# Altium project Venus Board V02.PrjPcb
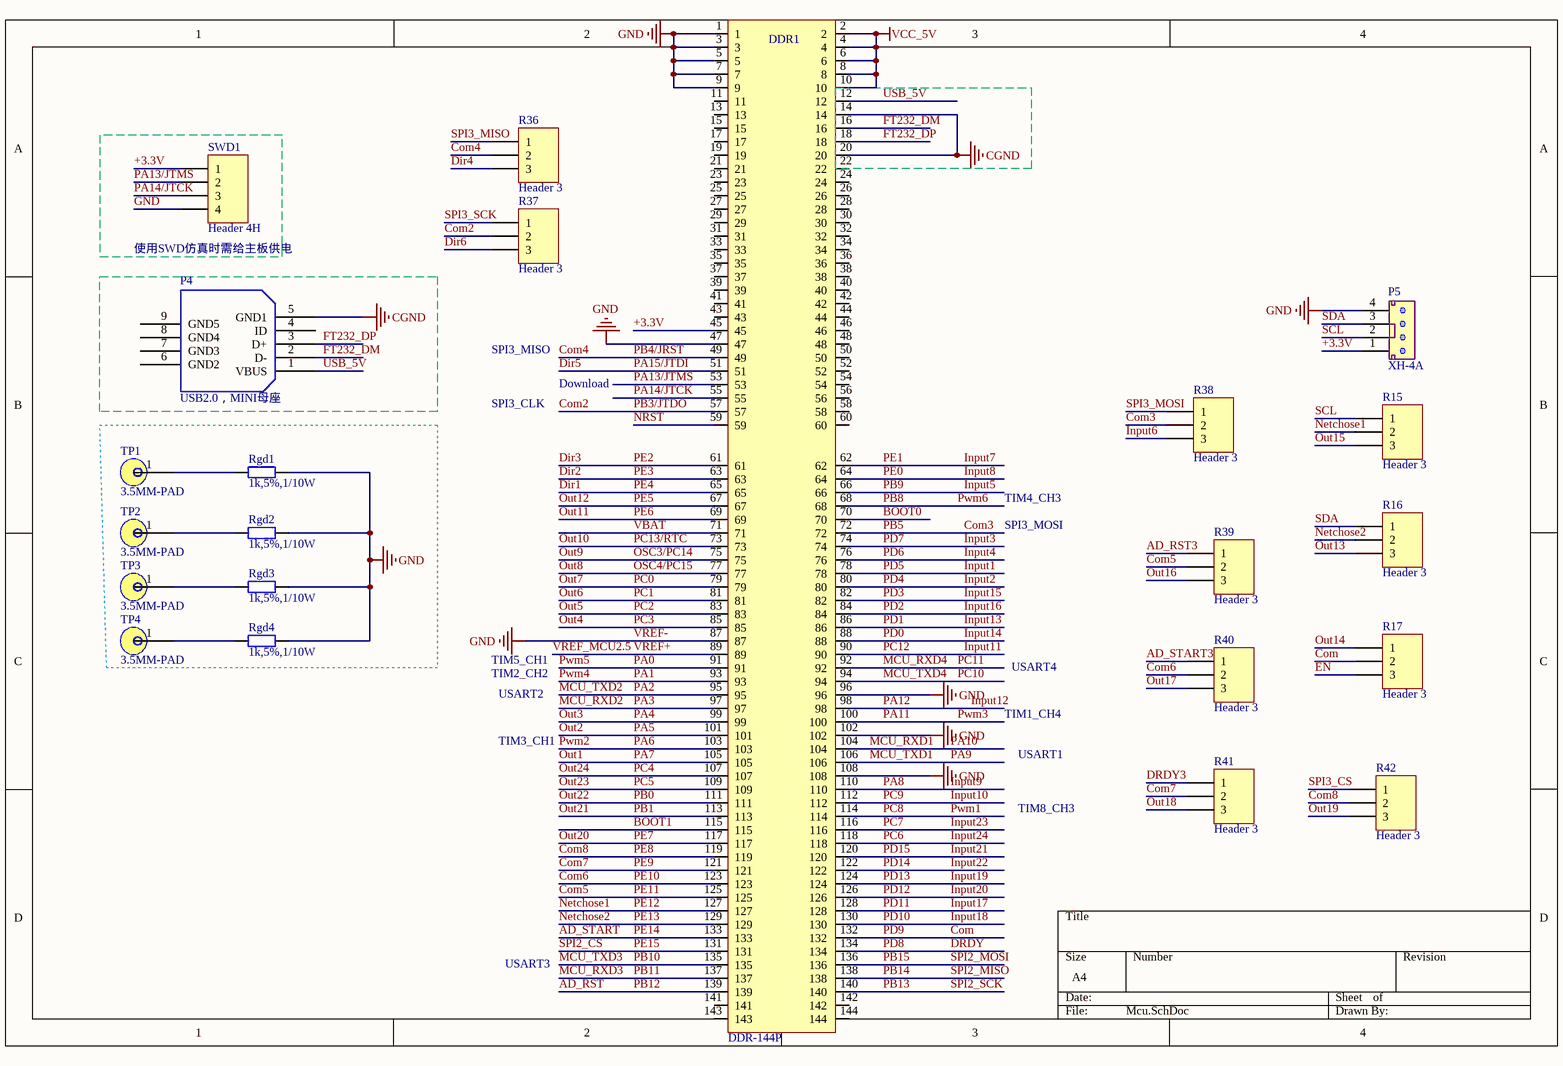
[diagram p0: Mcu.SchDoc]
7 sheets, 135 parts. Net scope: global (net labels, ports and power ports of the same name join across sheets).
Board file: Venus Board V02.PcbDoc
Sheets:
  Mcu.SchDoc
  Power.SchDoc
  Input.SchDoc
  Output.SchDoc
  Uart.SchDoc
  Motor.SchDoc
  ADS1248.SchDoc

## Sheet Mcu.SchDoc
size A4

### Parts
DDR1  DDR-144P  [DDRB-144P-0.8MM]
P4  USB2.0，MINI母座  [USB2.0-MINI]
P5  XH-4A  [CN4-3.5]
R15  Header 3  [3P-0603]
R16  Header 3  [3P-0603]
R17  Header 3  [3P-0603]
R36  Header 3  [3P-0603]
R37  Header 3  [3P-0603]
R38  Header 3  [3P-0603]
R39  Header 3  [3P-0603]
R40  Header 3  [3P-0603]
R41  Header 3  [3P-0603]
R42  Header 3  [3P-0603]
Rgd1  1k,5%,1/10W  [0603R]
Rgd2  1k,5%,1/10W  [0603R]
Rgd3  1k,5%,1/10W  [0603R]
Rgd4  1k,5%,1/10W  [0603R]
SWD1  Header 4H  [SIP4-2.54mm]
TP1  3.5MM-PAD  [PAD3.5mm]
TP2  3.5MM-PAD  [PAD3.5mm]
TP3  3.5MM-PAD  [PAD3.5mm]
TP4  3.5MM-PAD  [PAD3.5mm]

### Blocks framed on the sheet
使用SWD仿真时需给主板供电: SWD1

### Nets
+3.3V: DDR1.45 P5.1 SWD1.1
CGND: DDR1.14 DDR1.20 P4.5(GND1)
GND: DDR1.1 DDR1.3 DDR1.5 DDR1.7 DDR1.9 DDR1.47 DDR1.87 DDR1.96 DDR1.102 DDR1.108 P5.4 Rgd1.2 Rgd2.2 Rgd3.2 Rgd4.2 SWD1.4  [also labelled VREF-]
VCC_5V: DDR1.2 DDR1.4 DDR1.6 DDR1.8 DDR1.10
AD_RST: DDR1.139  [also labelled PB12]
AD_RST3: R39.1
AD_START: DDR1.133  [also labelled PE14]
AD_START3: R40.1
BOOT0: DDR1.70
BOOT1: DDR1.115
Com: DDR1.132 R17.2  [also labelled PD9]
Com2: DDR1.57 R37.2  [also labelled PB3/JTDO]
Com3: DDR1.72 R38.2  [also labelled PB5]
Com4: DDR1.49 R36.2  [also labelled PB4/JRST]
Com5: DDR1.125 R39.2  [also labelled PE11]
Com6: DDR1.123 R40.2  [also labelled PE10]
Com7: DDR1.121 R41.2  [also labelled PE9]
Com8: DDR1.119 R42.2  [also labelled PE8]
Dir1: DDR1.65  [also labelled PE4]
Dir2: DDR1.63  [also labelled PE3]
Dir3: DDR1.61  [also labelled PE2]
Dir4: R36.3
Dir5: DDR1.51  [also labelled PA15/JTDI]
Dir6: R37.3
DRDY: DDR1.134  [also labelled PD8]
DRDY3: R41.1
~{EN}: R17.3
FT232_DM: DDR1.16 P4.2(D-)
FT232_DP: DDR1.18 P4.3(D+)
Input1: DDR1.78  [also labelled PD5]
Input2: DDR1.80  [also labelled PD4]
Input3: DDR1.74  [also labelled PD7]
Input4: DDR1.76  [also labelled PD6]
Input5: DDR1.66  [also labelled PB9]
Input6: R38.3
Input7: DDR1.62  [also labelled PE1]
Input8: DDR1.64  [also labelled PE0]
Input9: DDR1.110  [also labelled PA8]
Input10: DDR1.112  [also labelled PC9]
Input11: DDR1.90  [also labelled PC12]
Input12: DDR1.98  [also labelled PA12]
Input13: DDR1.86  [also labelled PD1]
Input14: DDR1.88  [also labelled PD0]
Input15: DDR1.82  [also labelled PD3]
Input16: DDR1.84  [also labelled PD2]
Input17: DDR1.128  [also labelled PD11]
Input18: DDR1.130  [also labelled PD10]
Input19: DDR1.124  [also labelled PD13]
Input20: DDR1.126  [also labelled PD12]
Input21: DDR1.120  [also labelled PD15]
Input22: DDR1.122  [also labelled PD14]
Input23: DDR1.116  [also labelled PC7]
Input24: DDR1.118  [also labelled PC6]
MCU_RXD1: DDR1.104  [also labelled PA10]
MCU_RXD2: DDR1.97  [also labelled PA3]
MCU_RXD3: DDR1.137  [also labelled PB11]
MCU_RXD4: DDR1.92  [also labelled PC11]
MCU_TXD1: DDR1.106  [also labelled PA9]
MCU_TXD2: DDR1.95  [also labelled PA2]
MCU_TXD3: DDR1.135  [also labelled PB10]
MCU_TXD4: DDR1.94  [also labelled PC10]
Netchose1: DDR1.127 R15.2  [also labelled PE12]
Netchose2: DDR1.129 R16.2  [also labelled PE13]
NRST: DDR1.59
OSC3/PC14: DDR1.75  [also labelled Out9]
OSC4/PC15: DDR1.77  [also labelled Out8]
Out1: DDR1.105  [also labelled PA7]
Out2: DDR1.101  [also labelled PA5]
Out3: DDR1.99  [also labelled PA4]
Out4: DDR1.85  [also labelled PC3]
Out5: DDR1.83  [also labelled PC2]
Out6: DDR1.81  [also labelled PC1]
Out7: DDR1.79  [also labelled PC0]
Out10: DDR1.73  [also labelled PC13/RTC]
Out11: DDR1.69  [also labelled PE6]
Out12: DDR1.67  [also labelled PE5]
Out13: R16.3
Out14: R17.1
Out15: R15.3
Out16: R39.3
Out17: R40.3
Out18: R41.3
Out19: R42.3
Out20: DDR1.117  [also labelled PE7]
Out21: DDR1.113  [also labelled PB1]
Out22: DDR1.111  [also labelled PB0]
Out23: DDR1.109  [also labelled PC5]
Out24: DDR1.107  [also labelled PC4]
PA0: DDR1.91  [also labelled Pwm5]
PA1: DDR1.93  [also labelled Pwm4]
PA6: DDR1.103  [also labelled Pwm2]
PA11: DDR1.100  [also labelled Pwm3]
PA13/JTMS: DDR1.53 SWD1.2
PA14/JTCK: DDR1.55 SWD1.3
PB8: DDR1.68  [also labelled Pwm6]
PB13: DDR1.140  [also labelled SPI2_SCK]
PB14: DDR1.138  [also labelled SPI2_MISO]
PB15: DDR1.136  [also labelled SPI2_MOSI]
PC8: DDR1.114  [also labelled Pwm1]
PE15: DDR1.131  [also labelled SPI2_CS]
SCL: P5.2 R15.1
SDA: P5.3 R16.1
SPI3_CS: R42.1
SPI3_MISO: R36.1
SPI3_MOSI: R38.1
SPI3_SCK: R37.1
USB_5V: DDR1.12 P4.1(VBUS)
VBAT: DDR1.71
VREF+: DDR1.89  [also labelled VREF_MCU2.5]
NetRgd1_1: Rgd1.1 TP1.1
NetRgd2_1: Rgd2.1 TP2.1
NetRgd3_1: Rgd3.1 TP3.1
NetRgd4_1: Rgd4.1 TP4.1

Not connected (* = marked no-connect by the designer): DDR1 11 13 15 17 19 21 22 23 24 25 26 27 28 29 30 31 32 33 34 35 36 37 38 39 40 41 42 43 44 46 48 50 52 54 56 58 60 141 142 143 144; P4 4(ID) 6(GND2) 7(GND3) 8(GND4) 9(GND5)

### Notes on the sheet
- SPI3_MISO
- Download
- SPI3_CLK
- TIM4_CH3
- SPI3_MOSI
- TIM5_CH1
- USART4
- TIM2_CH2
- USART2
- TIM1_CH4
- TIM3_CH1
- USART1
- TIM8_CH3
- USART3

### Library data of the parts
P4 = USB2.0-MINI: USB插座,MINI型母座,USB2.0; 料号: 10705-00008-00; 品名: 数据接口连接器
P5 = CON4
R15-R17 R36-R42 = Header 3: Header, 3-Pin; LatestRevisionDate: 17-Jul-2002; LatestRevisionNote: Re-released for DXP Platform.; Publisher: Altium Limited
Rgd1-Rgd4 = R1K-0603: Metal Film Resistance,金属膜电阻,1K,1%,1/10W,0603; 料号: 11011K0001-000
SWD1 = Header 4H: Header, 4-Pin, Right Angle; LatestRevisionDate: 17-Jul-2002; LatestRevisionNote: Re-released for DXP Platform.; Publisher: Altium Limited

## Sheet Power.SchDoc
size A4
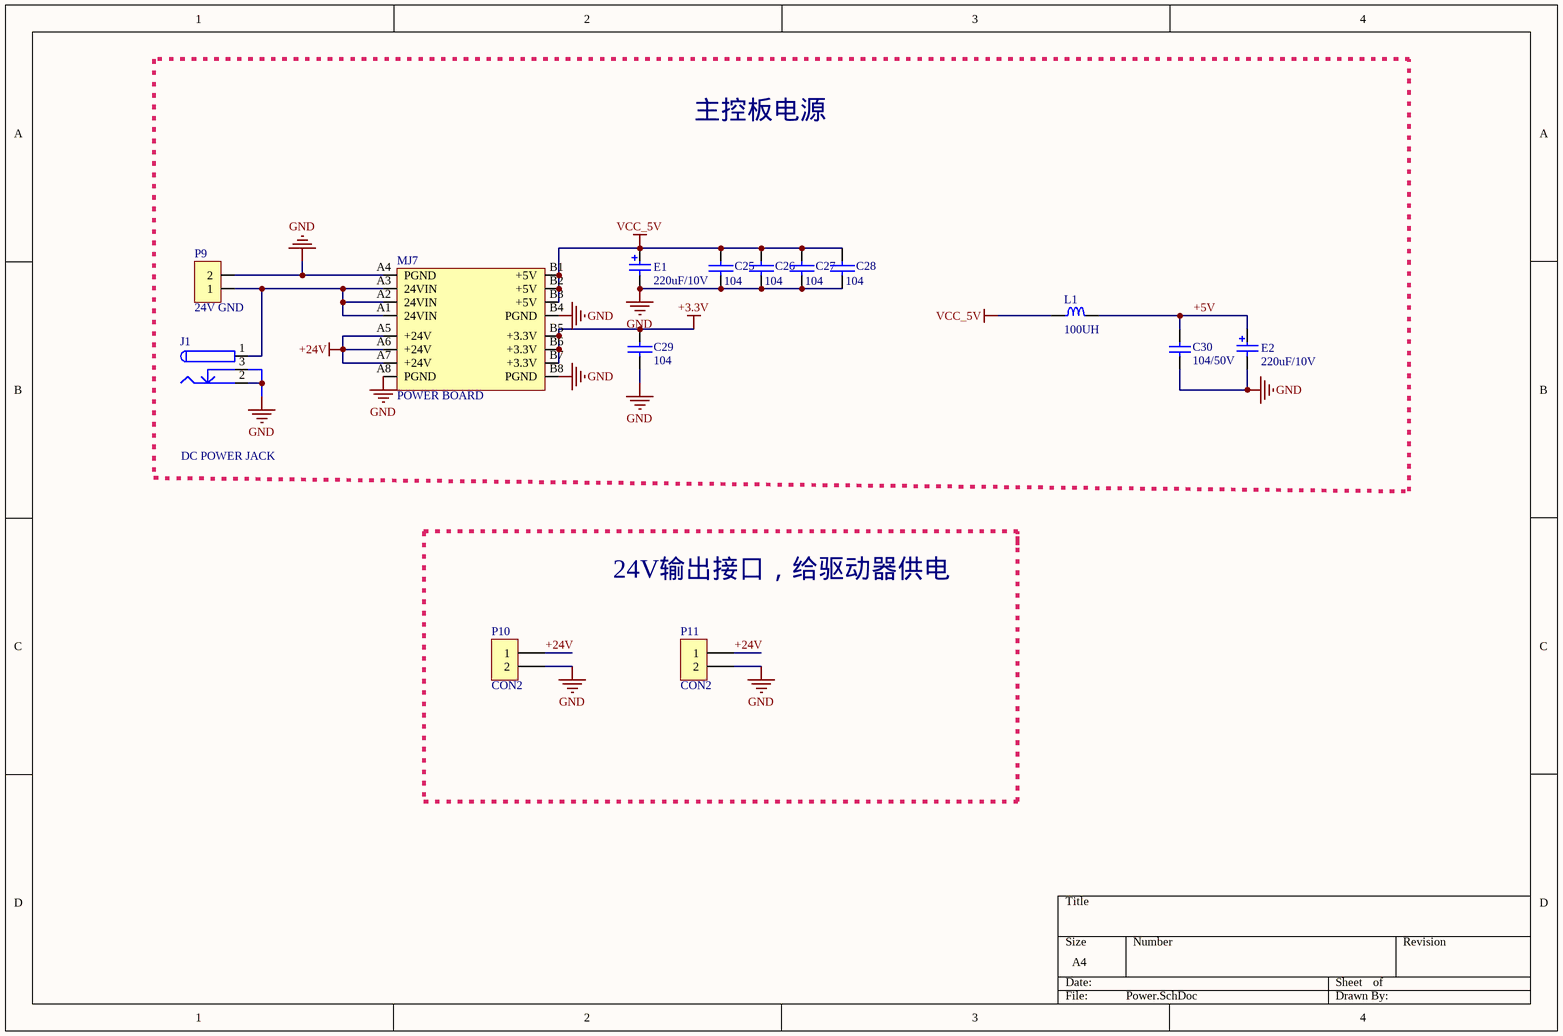
[diagram p1: Power.SchDoc]

### Parts
C25  104  [0603C]
C26  104  [0603C]
C27  104  [0603C]
C28  104  [0603C]
C29  104  [0603C]
C30  104/50V  [0603C]
E1  220uF/10V  [3216]
E2  220uF/10V  [3216]
J1  DC POWER JACK  [DC-005]
L1  100UH  [L-SMD7.4*7.4]
MJ7  POWER BOARD  [POWER BOARD]
P9  24V GND  [KF124-2P-3.5]
P10  CON2  [KF124-2P-3.5]
P11  CON2  [KF124-2P-3.5]

### Blocks framed on the sheet
主控板电源: C25-C30 E1 E2 J1 L1 MJ7 P9

### Nets
+3.3V: C29.2 MJ7.B5(+3.3V) MJ7.B6(+3.3V) MJ7.B7(+3.3V)
+5V: C30.2 E2.1 L1.2
+24V: MJ7.A5(+24V) MJ7.A6(+24V) MJ7.A7(+24V) P10.1 P11.1
GND: C25.2 C26.2 C27.2 C28.2 C29.1 C30.1 E1.2 E2.2 J1.2 J1.3 MJ7.A4(PGND) MJ7.A8(PGND) MJ7.B4(PGND) MJ7.B8(PGND) P9.2 P10.2 P11.2
VCC_5V: C25.1 C26.1 C27.1 C28.1 E1.1 L1.1 MJ7.B1(+5V) MJ7.B2(+5V) MJ7.B3(+5V)
NetJ1_1: J1.1 MJ7.A1(24VIN) MJ7.A2(24VIN) MJ7.A3(24VIN) P9.1

### Notes on the sheet
- 24V输出接口，给驱动器供电

### Library data of the parts
C25-C28 = CAP: Capacitor
C29 = CAP
C30 = C10uF/50V-0805: 瓷片电容,10uF,5%,X7R,50V,0805; 料号: 10201-10053-00; 品名: 瓷片电容
E1 E2 = 电解电容: Bi-Polar Capacitor; Value: 220uF/10V
L1 = INDUCTOR: 电感
MJ7 = J-PW
P9 = KF127-5.08-2P: 欧式接线端子，KF127-5.08-2P,2PIN，5.08mm; 料号: 10701-00036-00; 品名: 线对板连接器

## Sheet Input.SchDoc
size A4
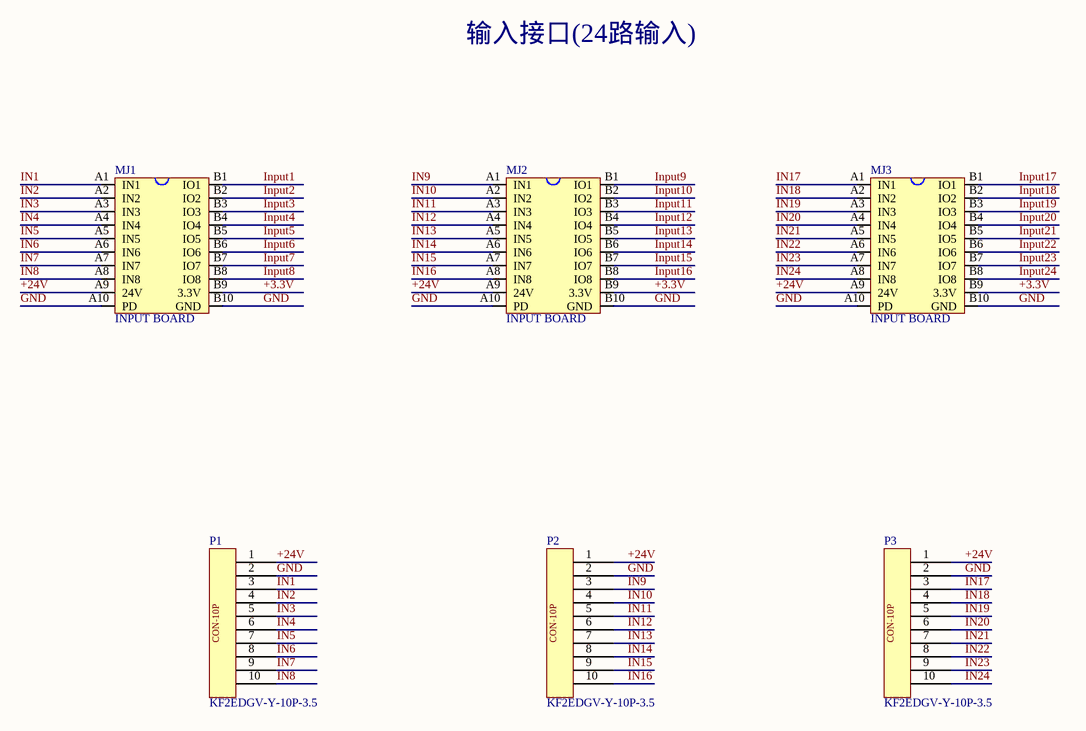
[diagram p2: Input.SchDoc]

### Parts
MJ1  INPUT BOARD  [INPUT BOARD]
MJ2  INPUT BOARD  [INPUT BOARD]
MJ3  INPUT BOARD  [INPUT BOARD]
P1  KF2EDGV-Y-10P-3.5  [KF2EDGV-Y-10P-3.5]
P2  KF2EDGV-Y-10P-3.5  [KF2EDGV-Y-10P-3.5]
P3  KF2EDGV-Y-10P-3.5  [KF2EDGV-Y-10P-3.5]

### Nets
+3.3V: MJ1.B9(3.3V) MJ2.B9(3.3V) MJ3.B9(3.3V)
+24V: MJ1.A9(24V) MJ2.A9(24V) MJ3.A9(24V) P1.1 P2.1 P3.1
GND: MJ1.A10(PD) MJ1.B10(GND) MJ2.A10(PD) MJ2.B10(GND) MJ3.A10(PD) MJ3.B10(GND) P1.2 P2.2 P3.2
IN1: MJ1.A1(IN1) P1.3
IN2: MJ1.A2(IN2) P1.4
IN3: MJ1.A3(IN3) P1.5
IN4: MJ1.A4(IN4) P1.6
IN5: MJ1.A5(IN5) P1.7
IN6: MJ1.A6(IN6) P1.8
IN7: MJ1.A7(IN7) P1.9
IN8: MJ1.A8(IN8) P1.10
IN9: MJ2.A1(IN1) P2.3
IN10: MJ2.A2(IN2) P2.4
IN11: MJ2.A3(IN3) P2.5
IN12: MJ2.A4(IN4) P2.6
IN13: MJ2.A5(IN5) P2.7
IN14: MJ2.A6(IN6) P2.8
IN15: MJ2.A7(IN7) P2.9
IN16: MJ2.A8(IN8) P2.10
IN17: MJ3.A1(IN1) P3.3
IN18: MJ3.A2(IN2) P3.4
IN19: MJ3.A3(IN3) P3.5
IN20: MJ3.A4(IN4) P3.6
IN21: MJ3.A5(IN5) P3.7
IN22: MJ3.A6(IN6) P3.8
IN23: MJ3.A7(IN7) P3.9
IN24: MJ3.A8(IN8) P3.10
Input1: MJ1.B1(IO1)
Input2: MJ1.B2(IO2)
Input3: MJ1.B3(IO3)
Input4: MJ1.B4(IO4)
Input5: MJ1.B5(IO5)
Input6: MJ1.B6(IO6)
Input7: MJ1.B7(IO7)
Input8: MJ1.B8(IO8)
Input9: MJ2.B1(IO1)
Input10: MJ2.B2(IO2)
Input11: MJ2.B3(IO3)
Input12: MJ2.B4(IO4)
Input13: MJ2.B5(IO5)
Input14: MJ2.B6(IO6)
Input15: MJ2.B7(IO7)
Input16: MJ2.B8(IO8)
Input17: MJ3.B1(IO1)
Input18: MJ3.B2(IO2)
Input19: MJ3.B3(IO3)
Input20: MJ3.B4(IO4)
Input21: MJ3.B5(IO5)
Input22: MJ3.B6(IO6)
Input23: MJ3.B7(IO7)
Input24: MJ3.B8(IO8)

### Notes on the sheet
- 输入接口(24路输入)

### Library data of the parts
MJ1-MJ3 = J-INPUT
P1-P3 = CON-10P

## Sheet Output.SchDoc
size A4
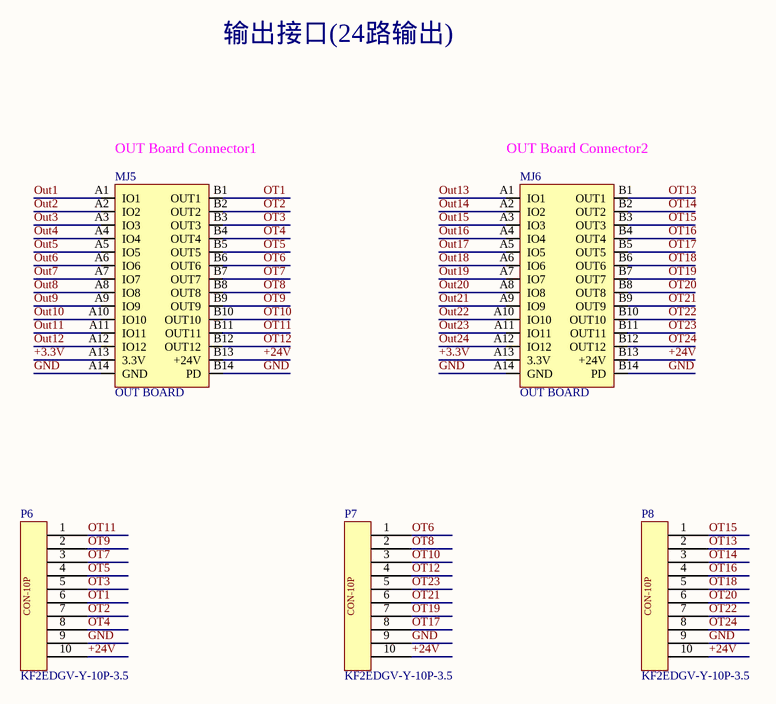
[diagram p3: Output.SchDoc]

### Parts
MJ5  OUT BOARD  [OUT BOARD]
MJ6  OUT BOARD  [OUT BOARD]
P6  KF2EDGV-Y-10P-3.5  [KF2EDGV-Y-10P-3.5]
P7  KF2EDGV-Y-10P-3.5  [KF2EDGV-Y-10P-3.5]
P8  KF2EDGV-Y-10P-3.5  [KF2EDGV-Y-10P-3.5]

### Nets
+3.3V: MJ5.A13(3.3V) MJ6.A13(3.3V)
+24V: MJ5.B13(+24V) MJ6.B13(+24V) P6.10 P7.10 P8.10
GND: MJ5.A14(GND) MJ5.B14(PD) MJ6.A14(GND) MJ6.B14(PD) P6.9 P7.9 P8.9
OT1: MJ5.B1(OUT1) P6.6
OT2: MJ5.B2(OUT2) P6.7
OT3: MJ5.B3(OUT3) P6.5
OT4: MJ5.B4(OUT4) P6.8
OT5: MJ5.B5(OUT5) P6.4
OT6: MJ5.B6(OUT6) P7.1
OT7: MJ5.B7(OUT7) P6.3
OT8: MJ5.B8(OUT8) P7.2
OT9: MJ5.B9(OUT9) P6.2
OT10: MJ5.B10(OUT10) P7.3
OT11: MJ5.B11(OUT11) P6.1
OT12: MJ5.B12(OUT12) P7.4
OT13: MJ6.B1(OUT1) P8.2
OT14: MJ6.B2(OUT2) P8.3
OT15: MJ6.B3(OUT3) P8.1
OT16: MJ6.B4(OUT4) P8.4
OT17: MJ6.B5(OUT5) P7.8
OT18: MJ6.B6(OUT6) P8.5
OT19: MJ6.B7(OUT7) P7.7
OT20: MJ6.B8(OUT8) P8.6
OT21: MJ6.B9(OUT9) P7.6
OT22: MJ6.B10(OUT10) P8.7
OT23: MJ6.B11(OUT11) P7.5
OT24: MJ6.B12(OUT12) P8.8
Out1: MJ5.A1(IO1)
Out2: MJ5.A2(IO2)
Out3: MJ5.A3(IO3)
Out4: MJ5.A4(IO4)
Out5: MJ5.A5(IO5)
Out6: MJ5.A6(IO6)
Out7: MJ5.A7(IO7)
Out8: MJ5.A8(IO8)  [project net OSC4/PC15]
Out9: MJ5.A9(IO9)  [project net OSC3/PC14]
Out10: MJ5.A10(IO10)
Out11: MJ5.A11(IO11)
Out12: MJ5.A12(IO12)
Out13: MJ6.A1(IO1)
Out14: MJ6.A2(IO2)
Out15: MJ6.A3(IO3)
Out16: MJ6.A4(IO4)
Out17: MJ6.A5(IO5)
Out18: MJ6.A6(IO6)
Out19: MJ6.A7(IO7)
Out20: MJ6.A8(IO8)
Out21: MJ6.A9(IO9)
Out22: MJ6.A10(IO10)
Out23: MJ6.A11(IO11)
Out24: MJ6.A12(IO12)

### Notes on the sheet
- 输出接口(24路输出)
- (near MJ5) OUT Board Connector1
- (near MJ6) OUT Board Connector2

### Library data of the parts
MJ5 MJ6 = J-OUTPUT
P6-P8 = CON-10P

## Sheet Uart.SchDoc
size A4
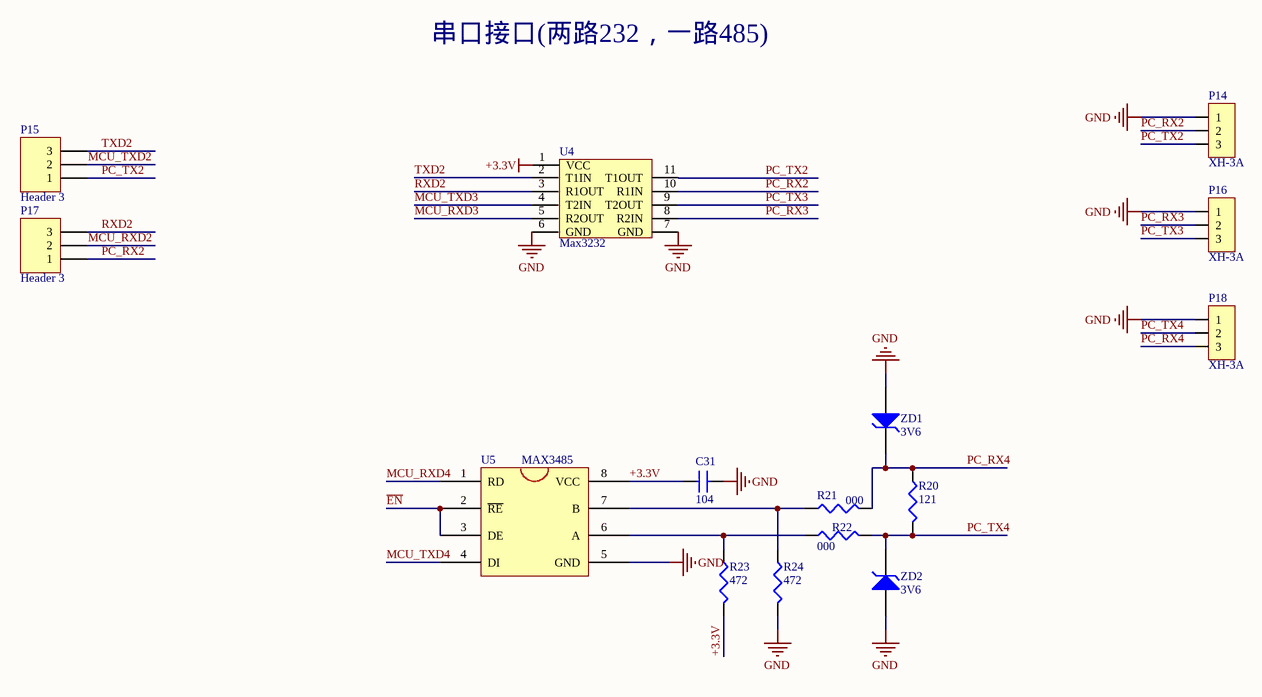
[diagram p4: Uart.SchDoc]

### Parts
C31  104  [0603C]
P14  XH-3A  [CN3-2.54]
P15  Header 3  [HDR1X3]
P16  XH-3A  [CN3-2.54]
P17  Header 3  [HDR1X3]
P18  XH-3A  [CN3-2.54]
R20  121  [0603R]
R21  000  [0603R]
R22  000  [0603R]
R23  472  [0603R]
R24  472  [0603R]
U4  Max3232  [Community V01]
U5  MAX3485  [SOP8]
ZD1  3V6  [SMA For SML4729A]
ZD2  3V6  [SMA For SML4729A]

### Nets
+3.3V: C31.1 R23.2 U4.1(VCC) U5.8(VCC)
GND: C31.2 P14.1 P16.1 P18.1 R24.2 U4.6(GND) U4.7(GND) U5.5(GND) ZD1.1 ZD2.1
~{EN}: U5.2(~{RE}) U5.3(DE)
MCU_RXD2: P17.2
MCU_RXD3: U4.5(R2OUT)
MCU_RXD4: U5.1(RD)
MCU_TXD2: P15.2
MCU_TXD3: U4.4(T2IN)
MCU_TXD4: U5.4(DI)
PC_RX2: P14.2 P17.1 U4.10(R1IN)
PC_RX3: P16.2 U4.8(R2IN)
PC_RX4: P18.3 R20.1 R21.2 ZD1.2
PC_TX2: P14.3 P15.1 U4.11(T1OUT)
PC_TX3: P16.3 U4.9(T2OUT)
PC_TX4: P18.2 R20.2 R22.2 ZD2.2
RXD2: P17.3 U4.3(R1OUT)
TXD2: P15.3 U4.2(T1IN)
NetR21_1: R21.1 R24.1 U5.7(B)
NetR22_1: R22.1 R23.1 U5.6(A)

### Notes on the sheet
- 串口接口(两路232，一路485)

### Library data of the parts
C31 = 电容: Capacitor; Value: 104
P14 P16 P18 = CONN-XH-3A: CONN,XH-3A,3PIN,2.54mm插座; 料号: 10701-00004-00; 品名: 线对板连接器
P15 P17 = Header 3: Header, 3-Pin; LatestRevisionDate: 17-Jul-2002; LatestRevisionNote: Re-released for DXP Platform.; Publisher: Altium Limited
R20-R24 = RES1
U4 = Community V01
U5 = MAX485
ZD1 ZD2 = 稳压二极管: constant diode

## Sheet Motor.SchDoc
size A4
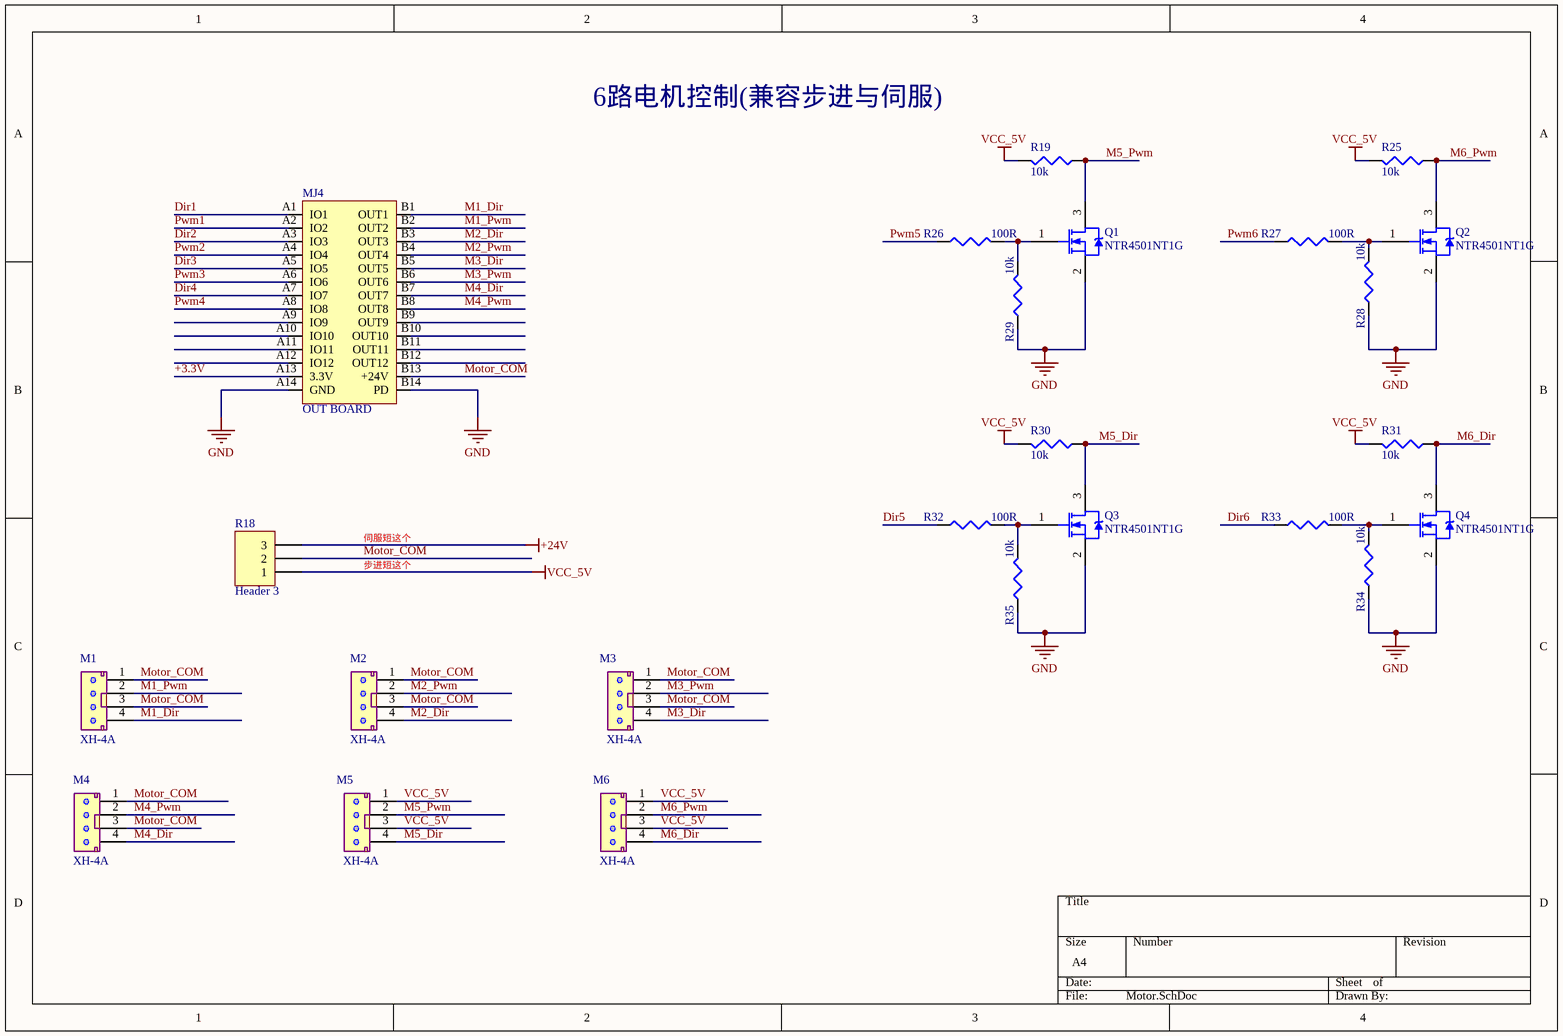
[diagram p5: Motor.SchDoc]

### Parts
M1  XH-4A  [CN4-3.5]
M2  XH-4A  [CN4-3.5]
M3  XH-4A  [CN4-3.5]
M4  XH-4A  [CN4-3.5]
M5  XH-4A  [CN4-3.5]
M6  XH-4A  [CN4-3.5]
MJ4  OUT BOARD  [OUT BOARD]
Q1  NTR4501NT1G  [SOT-23]
Q2  NTR4501NT1G  [SOT-23]
Q3  NTR4501NT1G  [SOT-23]
Q4  NTR4501NT1G  [SOT-23]
R18  Header 3  [3P-0603]
R19  10k  [0603R]
R25  10k  [0603R]
R26  100R  [0603R]
R27  100R  [0603R]
R28  10k  [0603R]
R29  10k  [0603R]
R30  10k  [0603R]
R31  10k  [0603R]
R32  100R  [0603R]
R33  100R  [0603R]
R34  10k  [0603R]
R35  10k  [0603R]

### Nets
+3.3V: MJ4.A13(3.3V)
+24V: R18.3
GND: MJ4.A14(GND) MJ4.B14(PD) Q1.2(S) Q2.2(S) Q3.2(S) Q4.2(S) R28.1 R29.1 R34.1 R35.1
VCC_5V: M5.1 M5.3 M6.1 M6.3 R18.1 R19.2 R25.2 R30.2 R31.2
Dir1: MJ4.A1(IO1)
Dir2: MJ4.A3(IO3)
Dir3: MJ4.A5(IO5)
Dir4: MJ4.A7(IO7)
Dir5: R32.1
Dir6: R33.1
M1_Dir: M1.4 MJ4.B1(OUT1)
M1_Pwm: M1.2 MJ4.B2(OUT2)
M2_Dir: M2.4 MJ4.B3(OUT3)
M2_Pwm: M2.2 MJ4.B4(OUT4)
M3_Dir: M3.4 MJ4.B5(OUT5)
M3_Pwm: M3.2 MJ4.B6(OUT6)
M4_Dir: M4.4 MJ4.B7(OUT7)
M4_Pwm: M4.2 MJ4.B8(OUT8)
M5_Dir: M5.4 Q3.3(D) R30.1
M5_Pwm: M5.2 Q1.3(D) R19.1
M6_Dir: M6.4 Q4.3(D) R31.1
M6_Pwm: M6.2 Q2.3(D) R25.1
Motor_COM: M1.1 M1.3 M2.1 M2.3 M3.1 M3.3 M4.1 M4.3 MJ4.B13(+24V) R18.2
Pwm1: MJ4.A2(IO2)  [project net PC8]
Pwm2: MJ4.A4(IO4)  [project net PA6]
Pwm3: MJ4.A6(IO6)  [project net PA11]
Pwm4: MJ4.A8(IO8)  [project net PA1]
Pwm5: R26.1  [project net PA0]
Pwm6: R27.1  [project net PB8]
NetQ1_1: Q1.1(G) R26.2 R29.2
NetQ2_1: Q2.1(G) R27.2 R28.2
NetQ3_1: Q3.1(G) R32.2 R35.2
NetQ4_1: Q4.1(G) R33.2 R34.2

Not connected (* = marked no-connect by the designer): MJ4 A9(IO9) A10(IO10) A11(IO11) A12(IO12) B9(OUT9) B10(OUT10) B11(OUT11) B12(OUT12)

### Notes on the sheet
- 6路电机控制(兼容步进与伺服)
- 伺服短这个
- 步进短这个

### Library data of the parts
M1-M6 = CON4
MJ4 = J-OUTPUT
Q1-Q4 = MOSFET-N: MOSFET N沟道
R18 = Header 3: Header, 3-Pin; LatestRevisionDate: 17-Jul-2002; LatestRevisionNote: Re-released for DXP Platform.; Publisher: Altium Limited
R19 R25-R35 = RES1

## Sheet ADS1248.SchDoc
size A4
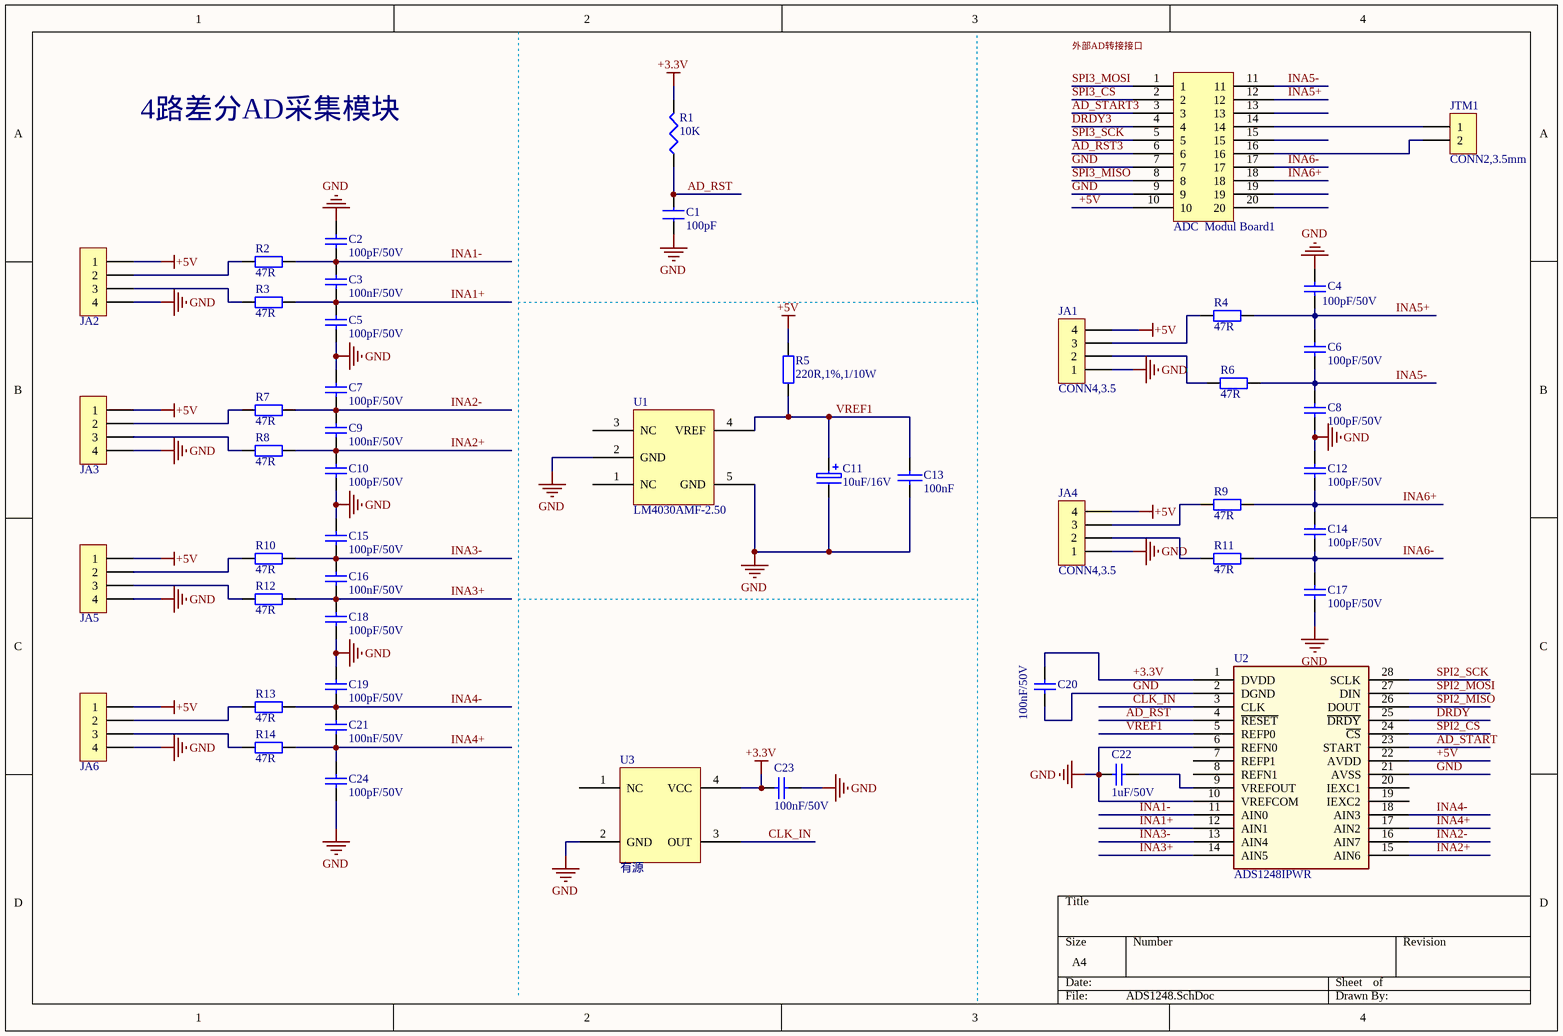
[diagram p6: ADS1248.SchDoc]

### Parts
ADC_Modul_Board1  ADC  Modul Board  [ADC  Modul Board]  (value not drawn)
C1  100pF  [0603C]
C2  100pF/50V  [0603C]
C3  100nF/50V  [0603C]
C4  100pF/50V  [0603C]
C5  100pF/50V  [0603C]
C6  100pF/50V  [0603C]
C7  100pF/50V  [0603C]
C8  100pF/50V  [0603C]
C9  100nF/50V  [0603C]
C10  100pF/50V  [0603C]
C11  10uF/16V  [3216]
C12  100pF/50V  [0603C]
C13  100nF  [0603C]
C14  100pF/50V  [0603C]
C15  100pF/50V  [0603C]
C16  100nF/50V  [0603C]
C17  100pF/50V  [0603C]
C18  100pF/50V  [0603C]
C19  100pF/50V  [0603C]
C20  100nF/50V  [0603C]
C21  100nF/50V  [0603C]
C22  1uF/50V  [0603C]
C23  100nF/50V  [0603C]
C24  100pF/50V  [0603C]
JA1  CONN4,3.5  [CN4-3.5]
JA2  XH-4A  [CN4-3.5]  (value not drawn)
JA3  XH-4A  [CN4-3.5]  (value not drawn)
JA4  CONN4,3.5  [CN4-3.5]
JA5  XH-4A  [CN4-3.5]  (value not drawn)
JA6  XH-4A  [CN4-3.5]  (value not drawn)
JTM1  CONN2,3.5mm  [KF124-2P-3.5]
R1  10K  [0603R]
R2  47R  [0603R]
R3  47R  [0603R]
R4  47R  [0603R]
R5  220R,1%,1/10W  [0603R]
R6  47R  [0603R]
R7  47R  [0603R]
R8  47R  [0603R]
R9  47R  [0603R]
R10  47R  [0603R]
R11  47R  [0603R]
R12  47R  [0603R]
R13  47R  [0603R]
R14  47R  [0603R]
U1  LM4030AMF-2.50  [SOT23-5]
U2  ADS1248IPWR  [SSOP28]
U3  有源  [ECS-3953C]

### Nets
+3.3V: C20.2 C23.2 R1.2 U2.1(DVDD) U3.4(VCC)
+5V: ADC_Modul_Board1.10 JA1.4 JA2.1 JA3.1 JA4.4 JA5.1 JA6.1 R5.1 U2.22(AVDD)
GND: ADC_Modul_Board1.7 ADC_Modul_Board1.9 C1.2 C2.2 C4.2 C5.1 C7.2 C8.1 C10.1 C11.2 C12.2 C13.2 C15.2 C17.1 C18.1 C19.2 C20.1 C22.1 C23.1 C24.1 JA1.1 JA2.4 JA3.4 JA4.1 JA5.4 JA6.4 U1.2(GND) U1.5(GND) U2.2(DGND) U2.6(REFN0) U2.10(VREFCOM) U2.21(AVSS) U3.2(GND)
AD_RST: C1.1 R1.1 U2.4(~{RESET})
AD_RST3: ADC_Modul_Board1.6
AD_START: U2.23(START)
AD_START3: ADC_Modul_Board1.3
CLK_IN: U2.3(CLK) U3.3(OUT)
DRDY: U2.25(~{DRDY})
DRDY3: ADC_Modul_Board1.4
INA1+: C3.1 C5.2 R3.2 U2.12(AIN1)
INA1-: C2.1 C3.2 R2.2 U2.11(AIN0)
INA2+: C9.1 C10.2 R8.2 U2.15(AIN6)
INA2-: C7.1 C9.2 R7.2 U2.16(AIN7)
INA3+: C16.1 C18.2 R12.2 U2.14(AIN5)
INA3-: C15.1 C16.2 R10.2 U2.13(AIN4)
INA4+: C21.1 C24.2 R14.2 U2.17(AIN2)
INA4-: C19.1 C21.2 R13.2 U2.18(AIN3)
INA5+: ADC_Modul_Board1.12 C4.1 C6.2 R4.2
INA5-: ADC_Modul_Board1.11 C6.1 C8.2 R6.2
INA6+: ADC_Modul_Board1.18 C12.1 C14.2 R9.2
INA6-: ADC_Modul_Board1.17 C14.1 C17.2 R11.2
SPI2_CS: U2.24(~{CS})  [project net PE15]
SPI2_MISO: U2.26(DOUT)  [project net PB14]
SPI2_MOSI: U2.27(DIN)  [project net PB15]
SPI2_SCK: U2.28(SCLK)  [project net PB13]
SPI3_CS: ADC_Modul_Board1.2
SPI3_MISO: ADC_Modul_Board1.8
SPI3_MOSI: ADC_Modul_Board1.1
SPI3_SCK: ADC_Modul_Board1.5
VREF1: C11.1 C13.1 R5.2 U1.4(VREF) U2.5(REFP0)
NetADC_Modul_Board1_14: ADC_Modul_Board1.14 JTM1.1
NetADC_Modul_Board1_16: ADC_Modul_Board1.16 JTM1.2
NetC22_2: C22.2 U2.9(VREFOUT)
NetJA1_2: JA1.2 R6.1
NetJA1_3: JA1.3 R4.1
NetJA2_2: JA2.2 R2.1
NetJA2_3: JA2.3 R3.1
NetJA3_2: JA3.2 R7.1
NetJA3_3: JA3.3 R8.1
NetJA4_2: JA4.2 R11.1
NetJA4_3: JA4.3 R9.1
NetJA5_2: JA5.2 R10.1
NetJA5_3: JA5.3 R12.1
NetJA6_2: JA6.2 R13.1
NetJA6_3: JA6.3 R14.1

Not connected (* = marked no-connect by the designer): ADC_Modul_Board1 13 15 19 20; U1 1(NC) 3(NC); U2 7(REFP1) 8(REFN1) 19(IEXC2) 20(IEXC1); U3 1(NC)

### Notes on the sheet
- 外部AD转接接口
- 4路差分AD采集模块

### Library data of the parts
C1 = 电容: Capacitor; Value: 100nF
C2 C4-C8 C10 C12 C14 C15 C17-C19 C24 = C100pF/50V-0603: 瓷片电容,100pF,5%,X7R,50V,0603; 料号: 10201-10002-00; 品名: 瓷片电容
C3 C9 C16 C20 C21 C23 = C100nF/50V-0603: 瓷片电容,100nF,5%,X7R,50V,0603; 料号: 10201-10032-00; 品名: 瓷片电容
C11 = CAP2
C13 = CAP
C22 = C1uF/50V-0603: 瓷片电容,1uF,5%,X7R,50V,0603; 料号: 10201-10042-00; 品名: 瓷片电容
JA1 JA4 = KF2EDGV-Y-3.5-4P-14: 凤凰端子，KF2EDGV-Y-3.5-4P-14，4PIN，3.5mm，公母头套装; 料号: 10701-00104-00; 品名: 线对板连接器
JA2 JA3 JA5 JA6 = CON4
JTM1 = KF2EDGR3.5-2P: KF2EDGR3.5-2P，插座; 料号: 10701-00091-00; 品名: 线对板连接器
R1 R5 = RES1
R2-R4 R6-R14 = R47R-0603: 金属膜电阻,47R,1%,1/10W,0603; 料号: 10101-04702-00; 品名: 金属膜电阻
U1 = LM4030: Voltage adj; Published: 8-Jun-2000; LatestRevisionDate: 29-May-2009; LatestRevisionNote: IPC-7351 Footprint Added.; PackageVersion: Aug-1999; PackageReference: SOT-23B; Publisher: Altium Limited; PackageDescription: 3-Pin SOT-23 Package 0.95 mm Pitch, 2.4 mm Lead Span
U2 = ADS1248IPWR: IC，ADS1248IPWR，SSOP28; 料号: 10605-00006-9G; 品名: 数据转换芯片
U3 = ECS-3953C-250-TR: 有源晶振，ECS-3953C-250-TR,7.5*5.0; 料号: 11402-00001-00; 品名: 有源晶振

## Nets that join several sheets
+3.3V: Mcu (DDR1.45 P5.1 SWD1.1), Power (C29.2 MJ7.B5 MJ7.B6 MJ7.B7), Input (MJ1.B9 MJ2.B9 MJ3.B9), Output (MJ5.A13 MJ6.A13), Uart (C31.1 R23.2 U4.1 U5.8), Motor (MJ4.A13), ADS1248 (5 pins)
+5V: Power (C30.2 E2.1 L1.2), ADS1248 (9 pins)
+24V: Power (5 pins), Input (6 pins), Output (5 pins), Motor (R18.3)
GND: Mcu (16 pins), Power (17 pins), Input (9 pins), Output (7 pins), Uart (10 pins), Motor (10 pins), ADS1248 (33 pins)
VCC_5V: Mcu (5 pins), Power (9 pins), Motor (9 pins)
AD_RST: Mcu (DDR1.139), ADS1248 (C1.1 R1.1 U2.4)
AD_RST3: Mcu (R39.1), ADS1248 (ADC_Modul_Board1.6)
AD_START: Mcu (DDR1.133), ADS1248 (U2.23)
AD_START3: Mcu (R40.1), ADS1248 (ADC_Modul_Board1.3)
Dir1: Mcu (DDR1.65), Motor (MJ4.A1)
Dir2: Mcu (DDR1.63), Motor (MJ4.A3)
Dir3: Mcu (DDR1.61), Motor (MJ4.A5)
Dir4: Mcu (R36.3), Motor (MJ4.A7)
Dir5: Mcu (DDR1.51), Motor (R32.1)
Dir6: Mcu (R37.3), Motor (R33.1)
DRDY: Mcu (DDR1.134), ADS1248 (U2.25)
DRDY3: Mcu (R41.1), ADS1248 (ADC_Modul_Board1.4)
~{EN}: Mcu (R17.3), Uart (U5.2 U5.3)
Input1: Mcu (DDR1.78), Input (MJ1.B1)
Input2: Mcu (DDR1.80), Input (MJ1.B2)
Input3: Mcu (DDR1.74), Input (MJ1.B3)
Input4: Mcu (DDR1.76), Input (MJ1.B4)
Input5: Mcu (DDR1.66), Input (MJ1.B5)
Input6: Mcu (R38.3), Input (MJ1.B6)
Input7: Mcu (DDR1.62), Input (MJ1.B7)
Input8: Mcu (DDR1.64), Input (MJ1.B8)
Input9: Mcu (DDR1.110), Input (MJ2.B1)
Input10: Mcu (DDR1.112), Input (MJ2.B2)
Input11: Mcu (DDR1.90), Input (MJ2.B3)
Input12: Mcu (DDR1.98), Input (MJ2.B4)
Input13: Mcu (DDR1.86), Input (MJ2.B5)
Input14: Mcu (DDR1.88), Input (MJ2.B6)
Input15: Mcu (DDR1.82), Input (MJ2.B7)
Input16: Mcu (DDR1.84), Input (MJ2.B8)
Input17: Mcu (DDR1.128), Input (MJ3.B1)
Input18: Mcu (DDR1.130), Input (MJ3.B2)
Input19: Mcu (DDR1.124), Input (MJ3.B3)
Input20: Mcu (DDR1.126), Input (MJ3.B4)
Input21: Mcu (DDR1.120), Input (MJ3.B5)
Input22: Mcu (DDR1.122), Input (MJ3.B6)
Input23: Mcu (DDR1.116), Input (MJ3.B7)
Input24: Mcu (DDR1.118), Input (MJ3.B8)
MCU_RXD2: Mcu (DDR1.97), Uart (P17.2)
MCU_RXD3: Mcu (DDR1.137), Uart (U4.5)
MCU_RXD4: Mcu (DDR1.92), Uart (U5.1)
MCU_TXD2: Mcu (DDR1.95), Uart (P15.2)
MCU_TXD3: Mcu (DDR1.135), Uart (U4.4)
MCU_TXD4: Mcu (DDR1.94), Uart (U5.4)
OSC3/PC14: Mcu (DDR1.75), Output (MJ5.A9)
OSC4/PC15: Mcu (DDR1.77), Output (MJ5.A8)
Out1: Mcu (DDR1.105), Output (MJ5.A1)
Out2: Mcu (DDR1.101), Output (MJ5.A2)
Out3: Mcu (DDR1.99), Output (MJ5.A3)
Out4: Mcu (DDR1.85), Output (MJ5.A4)
Out5: Mcu (DDR1.83), Output (MJ5.A5)
Out6: Mcu (DDR1.81), Output (MJ5.A6)
Out7: Mcu (DDR1.79), Output (MJ5.A7)
Out10: Mcu (DDR1.73), Output (MJ5.A10)
Out11: Mcu (DDR1.69), Output (MJ5.A11)
Out12: Mcu (DDR1.67), Output (MJ5.A12)
Out13: Mcu (R16.3), Output (MJ6.A1)
Out14: Mcu (R17.1), Output (MJ6.A2)
Out15: Mcu (R15.3), Output (MJ6.A3)
Out16: Mcu (R39.3), Output (MJ6.A4)
Out17: Mcu (R40.3), Output (MJ6.A5)
Out18: Mcu (R41.3), Output (MJ6.A6)
Out19: Mcu (R42.3), Output (MJ6.A7)
Out20: Mcu (DDR1.117), Output (MJ6.A8)
Out21: Mcu (DDR1.113), Output (MJ6.A9)
Out22: Mcu (DDR1.111), Output (MJ6.A10)
Out23: Mcu (DDR1.109), Output (MJ6.A11)
Out24: Mcu (DDR1.107), Output (MJ6.A12)
PA0: Mcu (DDR1.91), Motor (R26.1)
PA1: Mcu (DDR1.93), Motor (MJ4.A8)
PA6: Mcu (DDR1.103), Motor (MJ4.A4)
PA11: Mcu (DDR1.100), Motor (MJ4.A6)
PB8: Mcu (DDR1.68), Motor (R27.1)
PB13: Mcu (DDR1.140), ADS1248 (U2.28)
PB14: Mcu (DDR1.138), ADS1248 (U2.26)
PB15: Mcu (DDR1.136), ADS1248 (U2.27)
PC8: Mcu (DDR1.114), Motor (MJ4.A2)
PE15: Mcu (DDR1.131), ADS1248 (U2.24)
SPI3_CS: Mcu (R42.1), ADS1248 (ADC_Modul_Board1.2)
SPI3_MISO: Mcu (R36.1), ADS1248 (ADC_Modul_Board1.8)
SPI3_MOSI: Mcu (R38.1), ADS1248 (ADC_Modul_Board1.1)
SPI3_SCK: Mcu (R37.1), ADS1248 (ADC_Modul_Board1.5)